# EAGLE design jinks_01_release (EAGLE 9.3.2)

## Sheet 1 of 4
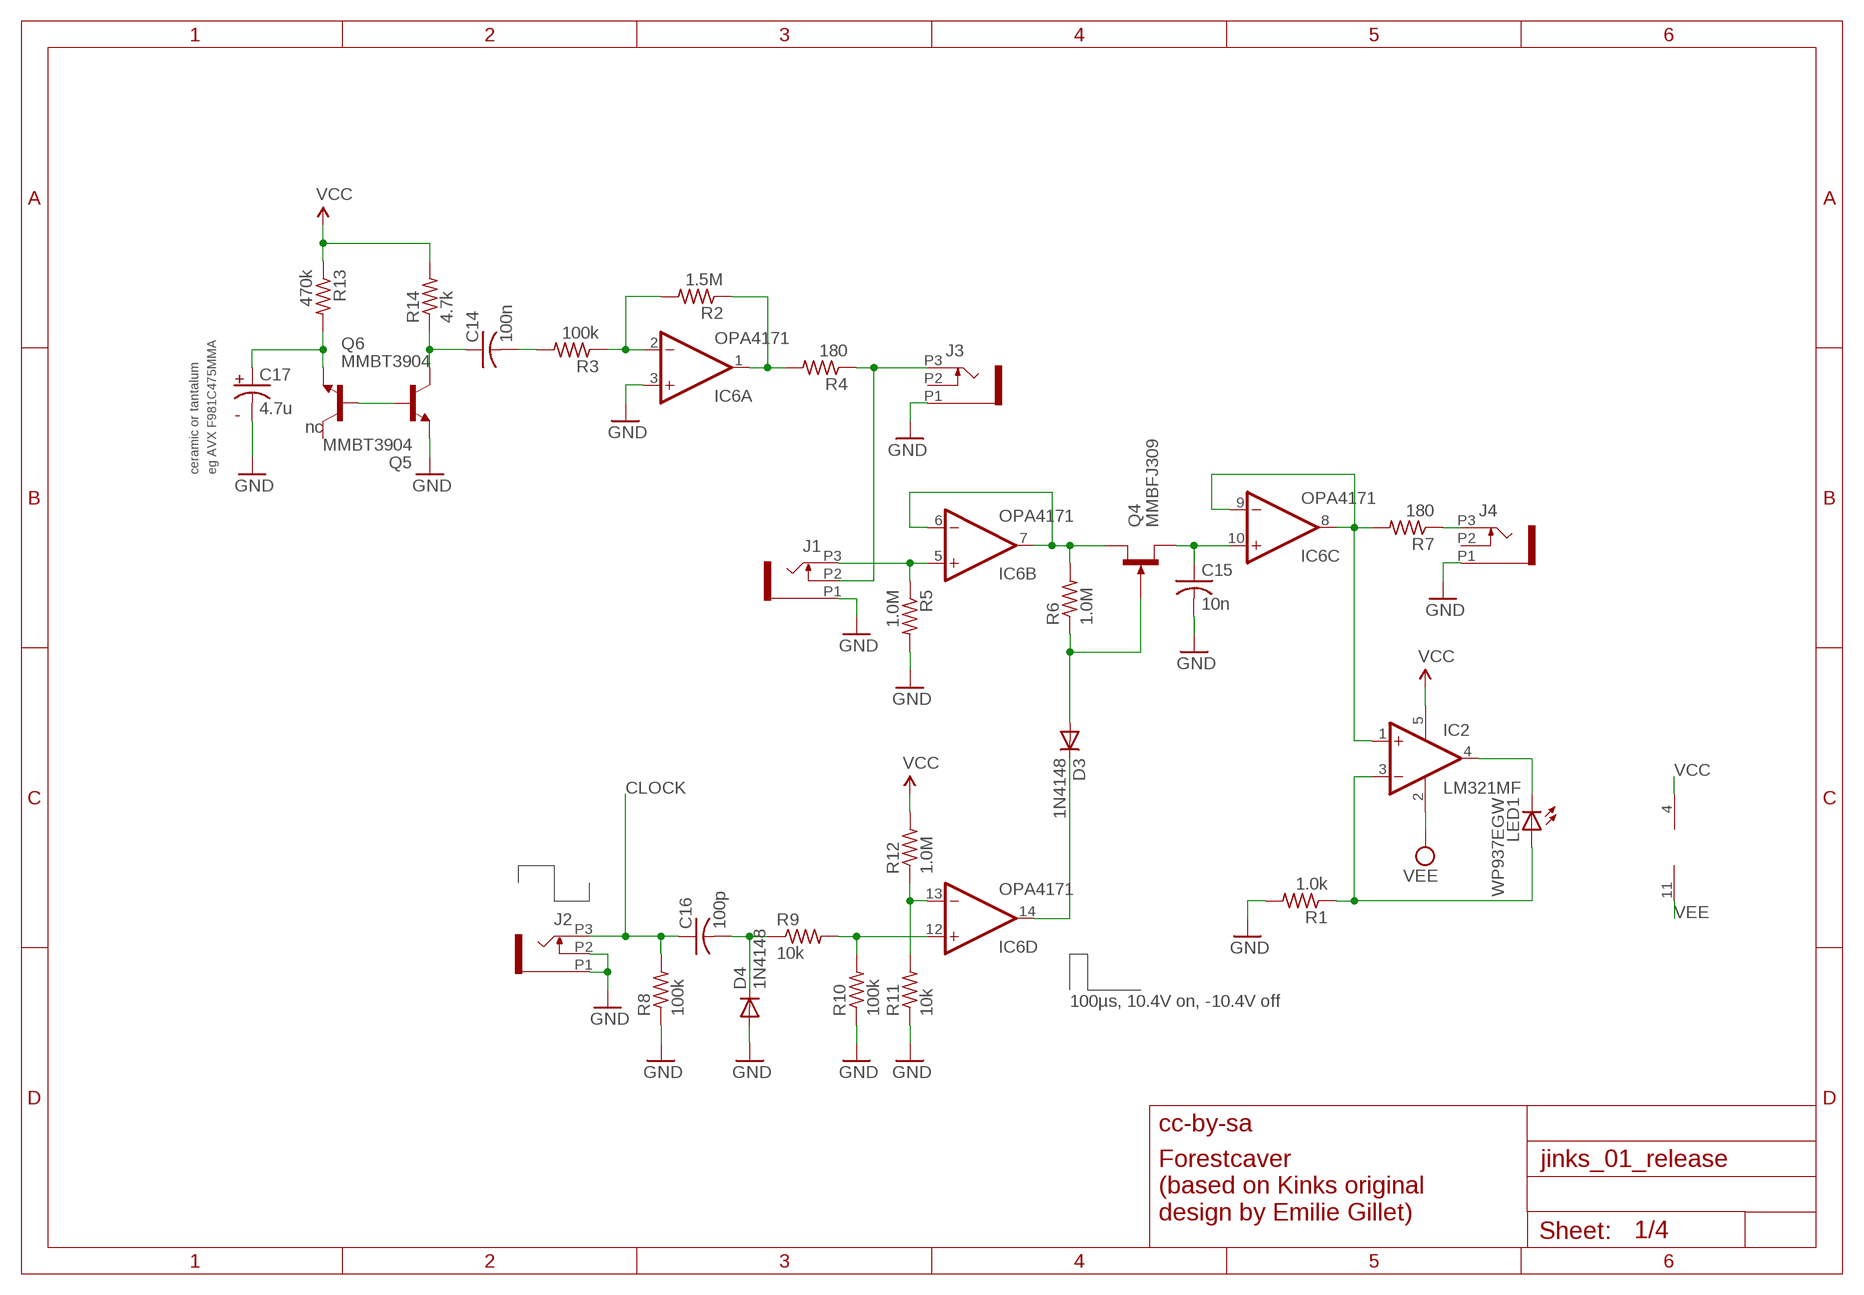
[diagram p0: schematic, sheet 1]

### Parts
C14  100n  C-USC0603  [C0603]
C15  10n  C-USC0603  [C0603]
C16  100p  C-USC0603  [C0603]
C17  4.7u  C-USC0603  [C0603]
D3  1N4148  DIODE-SOD523  [SOD523]
D4  1N4148  DIODE-SOD523  [SOD523]
IC2  LM321MF  [SOT23-5]
IC6  OPA4171  TL074PW  [TSSOP14]
J1  PJ301_THONKICONN6  [WQP_PJ_301M6]
J2  PJ301_THONKICONN6  [WQP_PJ_301M6]
J3  PJ301_THONKICONN6  [WQP_PJ_301M6]
J4  PJ301_THONKICONN6  [WQP_PJ_301M6]
LED1  WP937EGW  LED3MM  [LED3MM]
Q4  MMBFJ309  MMBFJ3  [SOT23]
Q5  MMBT3904  MMBT3904LT1-NPN-SOT23-BEC  [SOT23-BEC]
Q6  MMBT3904  MMBT3904LT1-NPN-SOT23-BEC  [SOT23-BEC]
R1  1.0k  R-US_R0603  [R0603]
R2  1.5M  R-US_R0603  [R0603]
R3  100k  R-US_R0603  [R0603]
R4  180  R-US_R0603  [R0603]
R5  1.0M  R-US_R0603  [R0603]
R6  1.0M  R-US_R0603  [R0603]
R7  180  R-US_R0603  [R0603]
R8  100k  R-US_R0603  [R0603]
R9  10k  R-US_R0603  [R0603]
R10  100k  R-US_R0603  [R0603]
R11  10k  R-US_R0603  [R0603]
R12  1.0M  R-US_R0603  [R0603]
R13  470k  R-US_R0603  [R0603]
R14  4.7k  R-US_R0603  [R0603]

### Nets
CLOCK: C16.1 J2.P3 R8.2 ; also sheet 2,3
GND: C15.2 C17.2 D4.A IC6.3(A:+IN) J1.P1 J2.P1 J2.P2 J3.P1 J4.P1 Q6.E R1.2 R5.2 R8.1 R10.1 R11.1 ; also sheet 2,3,4
N$1: IC2.4(OUT) LED1.K(C)
N$2: IC2.3(-IN) LED1.A R1.1
N$4: IC2.1(+IN) IC6.8(C:OUT) IC6.9(C:-IN) R7.2
N$5: IC6.1(A:OUT) R2.1 R4.2
N$7: J1.P2 J3.P3 R4.1
N$9: IC6.5(B:+IN) J1.P3 R5.1
N$10: IC6.6(B:-IN) IC6.7(B:OUT) Q4.1(D) R6.2
N$11: D3.A Q4.3(G) R6.1
N$14: D3.C IC6.14(D:OUT)
N$15: C15.1 IC6.10(C:+IN) Q4.2(S)
N$17: J4.P3 R7.1
N$21: C16.2 D4.C R9.1
N$23: IC6.12(D:+IN) R9.2 R10.2
N$24: IC6.13(D:-IN) R11.2 R12.1
N$25: C14.2 R3.2
N$26: IC6.2(A:-IN) R2.2 R3.1
N$27: Q5.B Q6.B
N$28: C17.1 Q5.E R13.2
N$29: C14.1 Q6.C R14.1
VCC: IC2.5(V+) IC6.4(P:V+) R12.2 R13.1 R14.2 ; also sheet 2,3,4
VEE: IC2.2(V-) IC6.11(P:V-) ; also sheet 2,3,4
Unconnected: J3.P2 J4.P2 Q5.C

### Notes on the sheet
- +
- - | nc
- ceramic or tantalum | eg AVX F981C475MMA
- 100µs, 10.4V on, -10.4V off
- cc-by-sa
- Forestcaver
  (based on Kinks original
  design by Emilie Gillet)

## Sheet 2 of 4
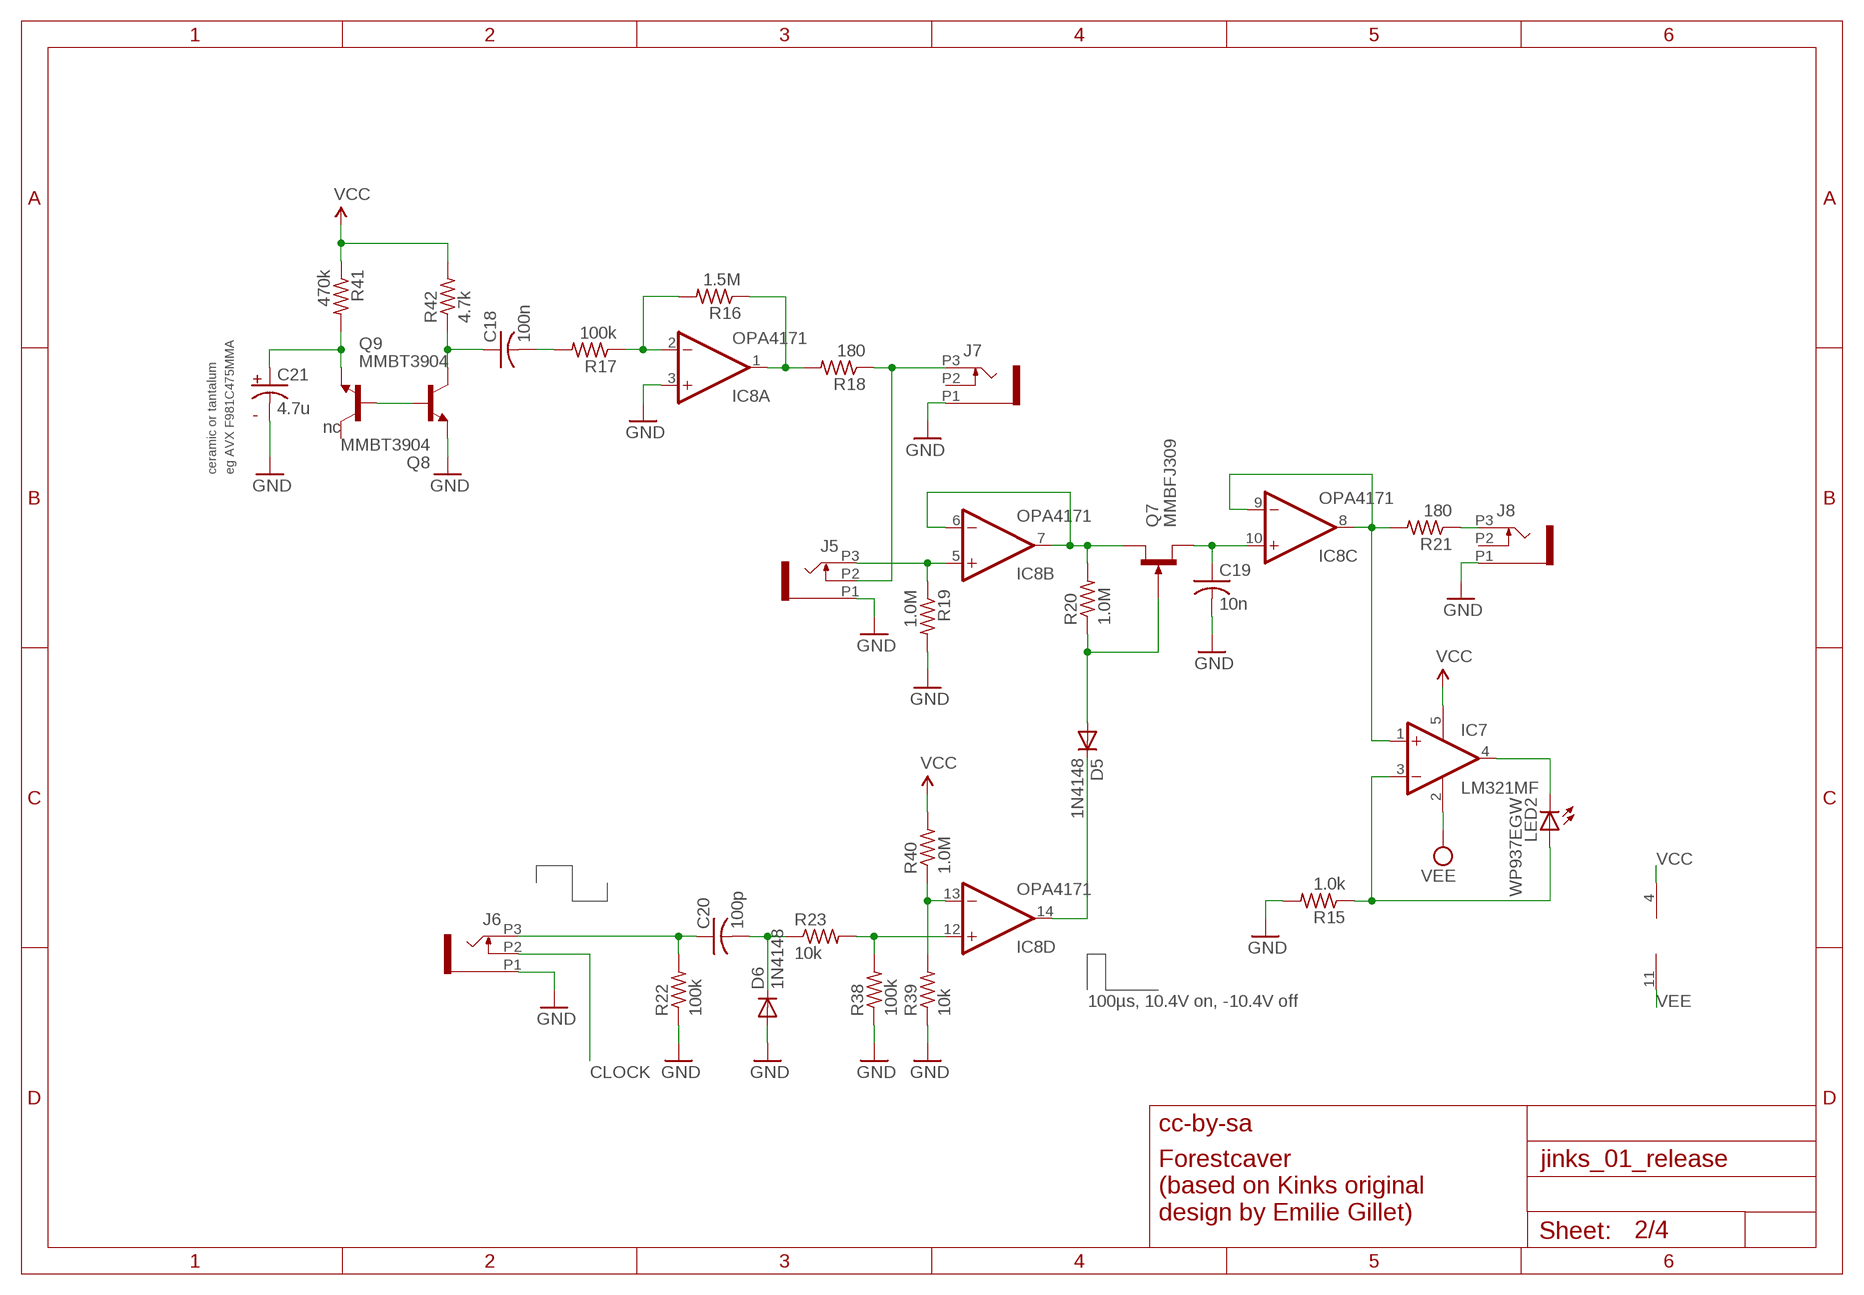
[diagram p1: schematic, sheet 2]

### Parts
C18  100n  C-USC0603  [C0603]
C19  10n  C-USC0603  [C0603]
C20  100p  C-USC0603  [C0603]
C21  4.7u  C-USC0603  [C0603]
D5  1N4148  DIODE-SOD523  [SOD523]
D6  1N4148  DIODE-SOD523  [SOD523]
IC7  LM321MF  [SOT23-5]
IC8  OPA4171  TL074PW  [TSSOP14]
J5  PJ301_THONKICONN6  [WQP_PJ_301M6]
J6  PJ301_THONKICONN6  [WQP_PJ_301M6]
J7  PJ301_THONKICONN6  [WQP_PJ_301M6]
J8  PJ301_THONKICONN6  [WQP_PJ_301M6]
LED2  WP937EGW  LED3MM  [LED3MM]
Q7  MMBFJ309  MMBFJ3  [SOT23]
Q8  MMBT3904  MMBT3904LT1-NPN-SOT23-BEC  [SOT23-BEC]
Q9  MMBT3904  MMBT3904LT1-NPN-SOT23-BEC  [SOT23-BEC]
R15  1.0k  R-US_R0603  [R0603]
R16  1.5M  R-US_R0603  [R0603]
R17  100k  R-US_R0603  [R0603]
R18  180  R-US_R0603  [R0603]
R19  1.0M  R-US_R0603  [R0603]
R20  1.0M  R-US_R0603  [R0603]
R21  180  R-US_R0603  [R0603]
R22  100k  R-US_R0603  [R0603]
R23  10k  R-US_R0603  [R0603]
R38  100k  R-US_R0603  [R0603]
R39  10k  R-US_R0603  [R0603]
R40  1.0M  R-US_R0603  [R0603]
R41  470k  R-US_R0603  [R0603]
R42  4.7k  R-US_R0603  [R0603]

### Nets
CLOCK: J6.P2 ; also sheet 1,3
GND: C19.2 C21.2 D6.A IC8.3(A:+IN) J5.P1 J6.P1 J7.P1 J8.P1 Q9.E R15.2 R19.2 R22.1 R38.1 R39.1 ; also sheet 1,3,4
N$32: IC7.4(OUT) LED2.K(C)
N$33: IC7.3(-IN) LED2.A R15.1
N$34: IC7.1(+IN) IC8.8(C:OUT) IC8.9(C:-IN) R21.2
N$35: IC8.1(A:OUT) R16.1 R18.2
N$38: J5.P2 J7.P3 R18.1
N$39: IC8.5(B:+IN) J5.P3 R19.1
N$47: IC8.6(B:-IN) IC8.7(B:OUT) Q7.1(D) R20.2
N$52: D5.A Q7.3(G) R20.1
N$53: D5.C IC8.14(D:OUT)
N$54: C19.1 IC8.10(C:+IN) Q7.2(S)
N$55: J8.P3 R21.1
N$56: C20.1 J6.P3 R22.2
N$57: C20.2 D6.C R23.1
N$58: IC8.12(D:+IN) R23.2 R38.2
N$59: IC8.13(D:-IN) R39.2 R40.1
N$60: C18.2 R17.2
N$61: IC8.2(A:-IN) R16.2 R17.1
N$62: Q8.B Q9.B
N$63: C21.1 Q8.E R41.2
N$64: C18.1 Q9.C R42.1
VCC: IC7.5(V+) IC8.4(P:V+) R40.2 R41.1 R42.2 ; also sheet 1,3,4
VEE: IC7.2(V-) IC8.11(P:V-) ; also sheet 1,3,4
Unconnected: J7.P2 J8.P2 Q8.C

### Notes on the sheet
- +
- - | nc
- ceramic or tantalum | eg AVX F981C475MMA
- 100µs, 10.4V on, -10.4V off
- cc-by-sa
- Forestcaver
  (based on Kinks original
  design by Emilie Gillet)

## Sheet 3 of 4
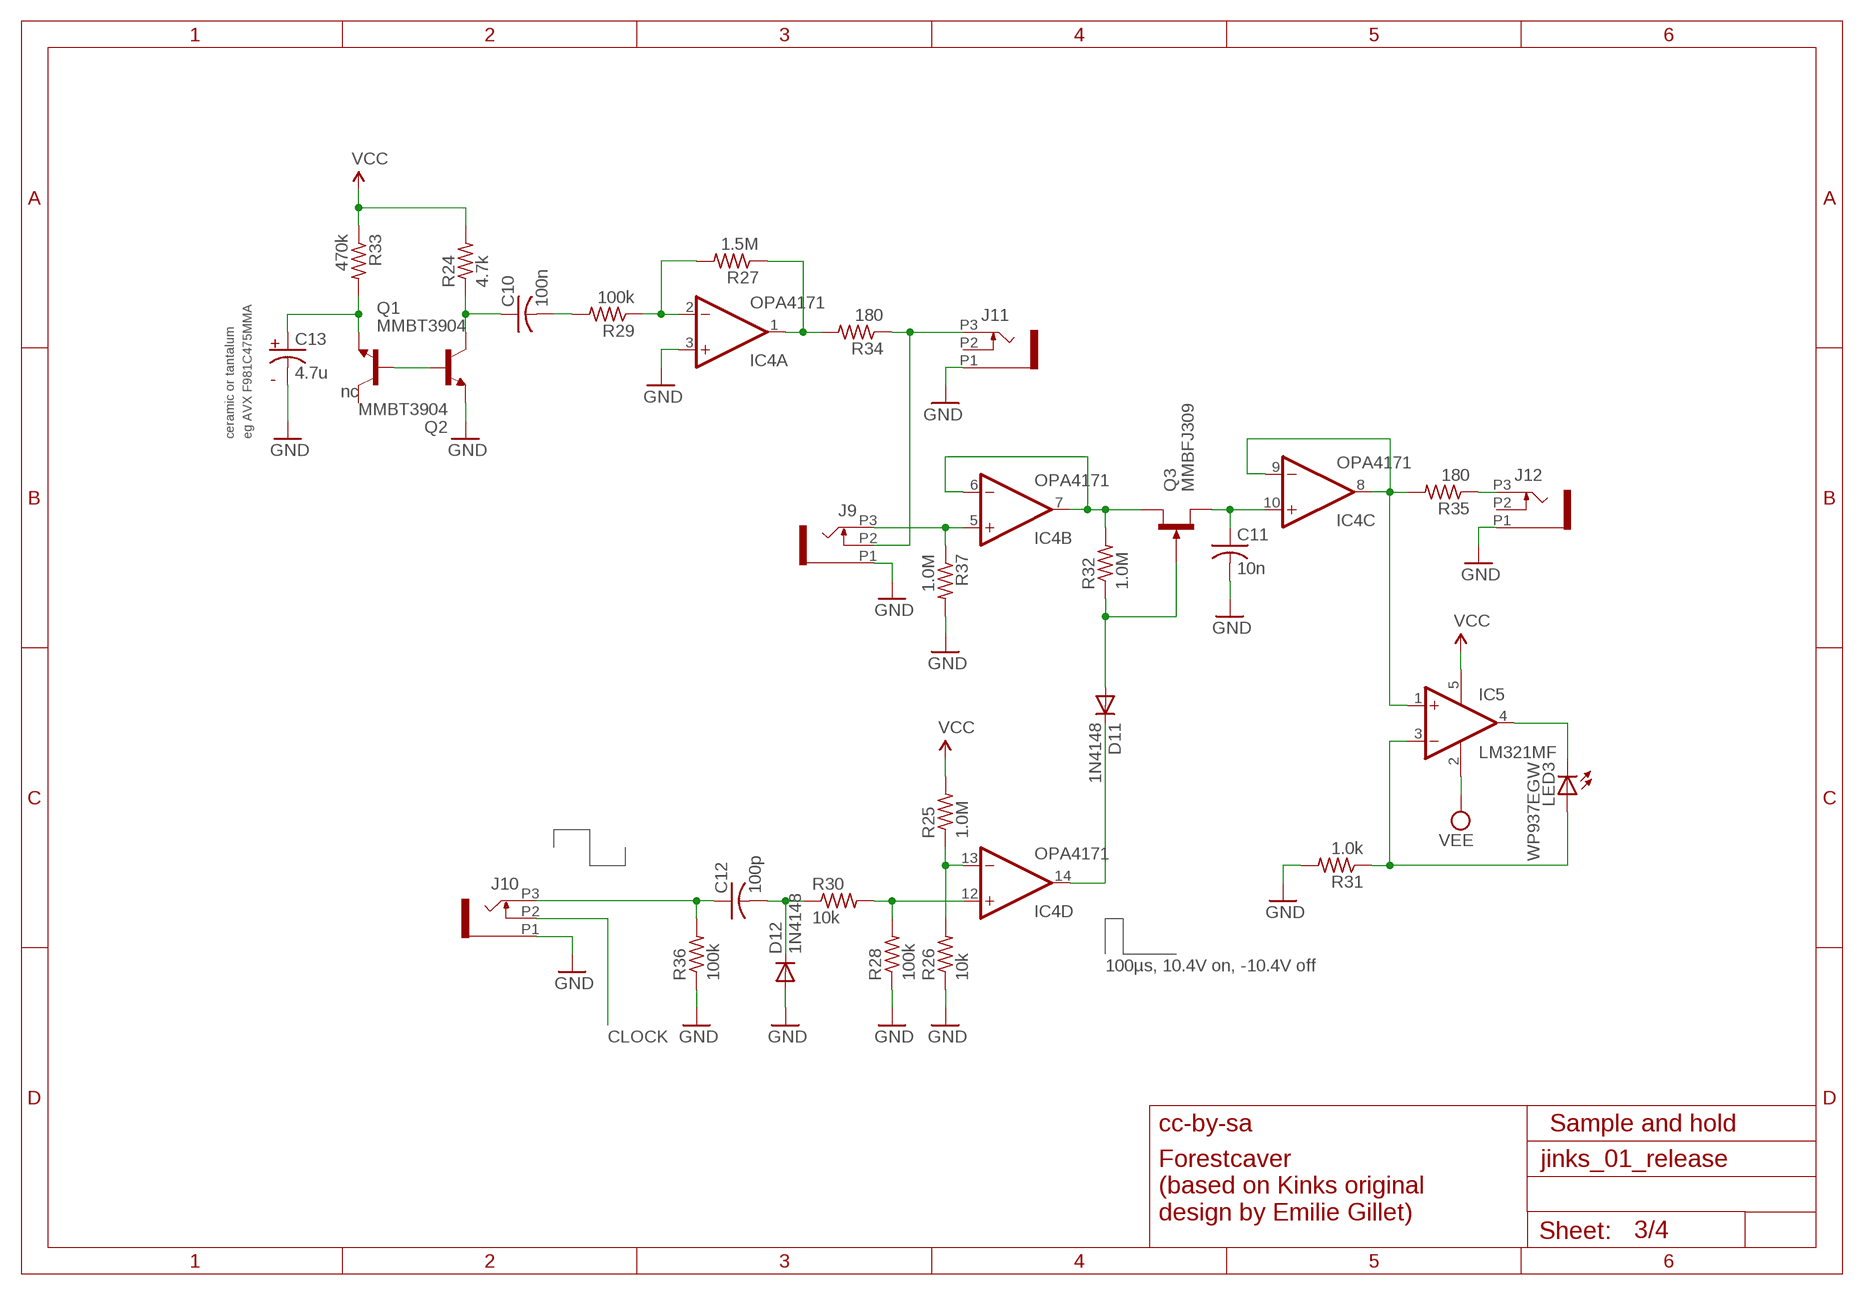
[diagram p2: schematic, sheet 3]

### Parts
C10  100n  C-USC0603  [C0603]
C11  10n  C-USC0603  [C0603]
C12  100p  C-USC0603  [C0603]
C13  4.7u  C-USC0603  [C0603]
D11  1N4148  DIODE-SOD523  [SOD523]
D12  1N4148  DIODE-SOD523  [SOD523]
IC4  OPA4171  TL074PW  [TSSOP14]
IC5  LM321MF  [SOT23-5]
J9  PJ301_THONKICONN6  [WQP_PJ_301M6]
J10  PJ301_THONKICONN6  [WQP_PJ_301M6]
J11  PJ301_THONKICONN6  [WQP_PJ_301M6]
J12  PJ301_THONKICONN6  [WQP_PJ_301M6]
LED3  WP937EGW  LED3MM  [LED3MM]
Q1  MMBT3904  MMBT3904LT1-NPN-SOT23-BEC  [SOT23-BEC]
Q2  MMBT3904  MMBT3904LT1-NPN-SOT23-BEC  [SOT23-BEC]
Q3  MMBFJ309  MMBFJ3  [SOT23]
R24  4.7k  R-US_R0603  [R0603]
R25  1.0M  R-US_R0603  [R0603]
R26  10k  R-US_R0603  [R0603]
R27  1.5M  R-US_R0603  [R0603]
R28  100k  R-US_R0603  [R0603]
R29  100k  R-US_R0603  [R0603]
R30  10k  R-US_R0603  [R0603]
R31  1.0k  R-US_R0603  [R0603]
R32  1.0M  R-US_R0603  [R0603]
R33  470k  R-US_R0603  [R0603]
R34  180  R-US_R0603  [R0603]
R35  180  R-US_R0603  [R0603]
R36  100k  R-US_R0603  [R0603]
R37  1.0M  R-US_R0603  [R0603]

### Nets
CLOCK: J10.P2 ; also sheet 1,2
GND: C11.2 C13.2 D12.A IC4.3(A:+IN) J9.P1 J10.P1 J11.P1 J12.P1 Q1.E R26.1 R28.1 R31.2 R36.1 R37.2 ; also sheet 1,2,4
N$3: IC4.8(C:OUT) IC4.9(C:-IN) IC5.1(+IN) R35.2
N$8: Q1.B Q2.B
N$12: C13.1 Q2.E R33.2
N$13: C10.2 R29.2
N$16: IC4.2(A:-IN) R27.2 R29.1
N$19: IC5.3(-IN) LED3.A R31.1
N$30: IC5.4(OUT) LED3.K(C)
N$31: C10.1 Q1.C R24.1
N$36: IC4.1(A:OUT) R27.1 R34.2
N$37: J9.P2 J11.P3 R34.1
N$40: IC4.5(B:+IN) J9.P3 R37.1
N$41: IC4.6(B:-IN) IC4.7(B:OUT) Q3.1(D) R32.2
N$42: D11.A Q3.3(G) R32.1
N$43: D11.C IC4.14(D:OUT)
N$45: C11.1 IC4.10(C:+IN) Q3.2(S)
N$46: IC4.12(D:+IN) R28.2 R30.2
N$48: J12.P3 R35.1
N$49: C12.1 J10.P3 R36.2
N$50: IC4.13(D:-IN) R25.1 R26.2
N$51: C12.2 D12.C R30.1
VCC: IC5.5(V+) R24.2 R25.2 R33.1 ; also sheet 1,2,4
VEE: IC5.2(V-) ; also sheet 1,2,4
Unconnected: J11.P2 J12.P2 Q2.C

### Notes on the sheet
- +
- - | nc
- ceramic or tantalum | eg AVX F981C475MMA
- 100µs, 10.4V on, -10.4V off
- cc-by-sa | Sample and hold
- Forestcaver
  (based on Kinks original
  design by Emilie Gillet)

## Sheet 4 of 4
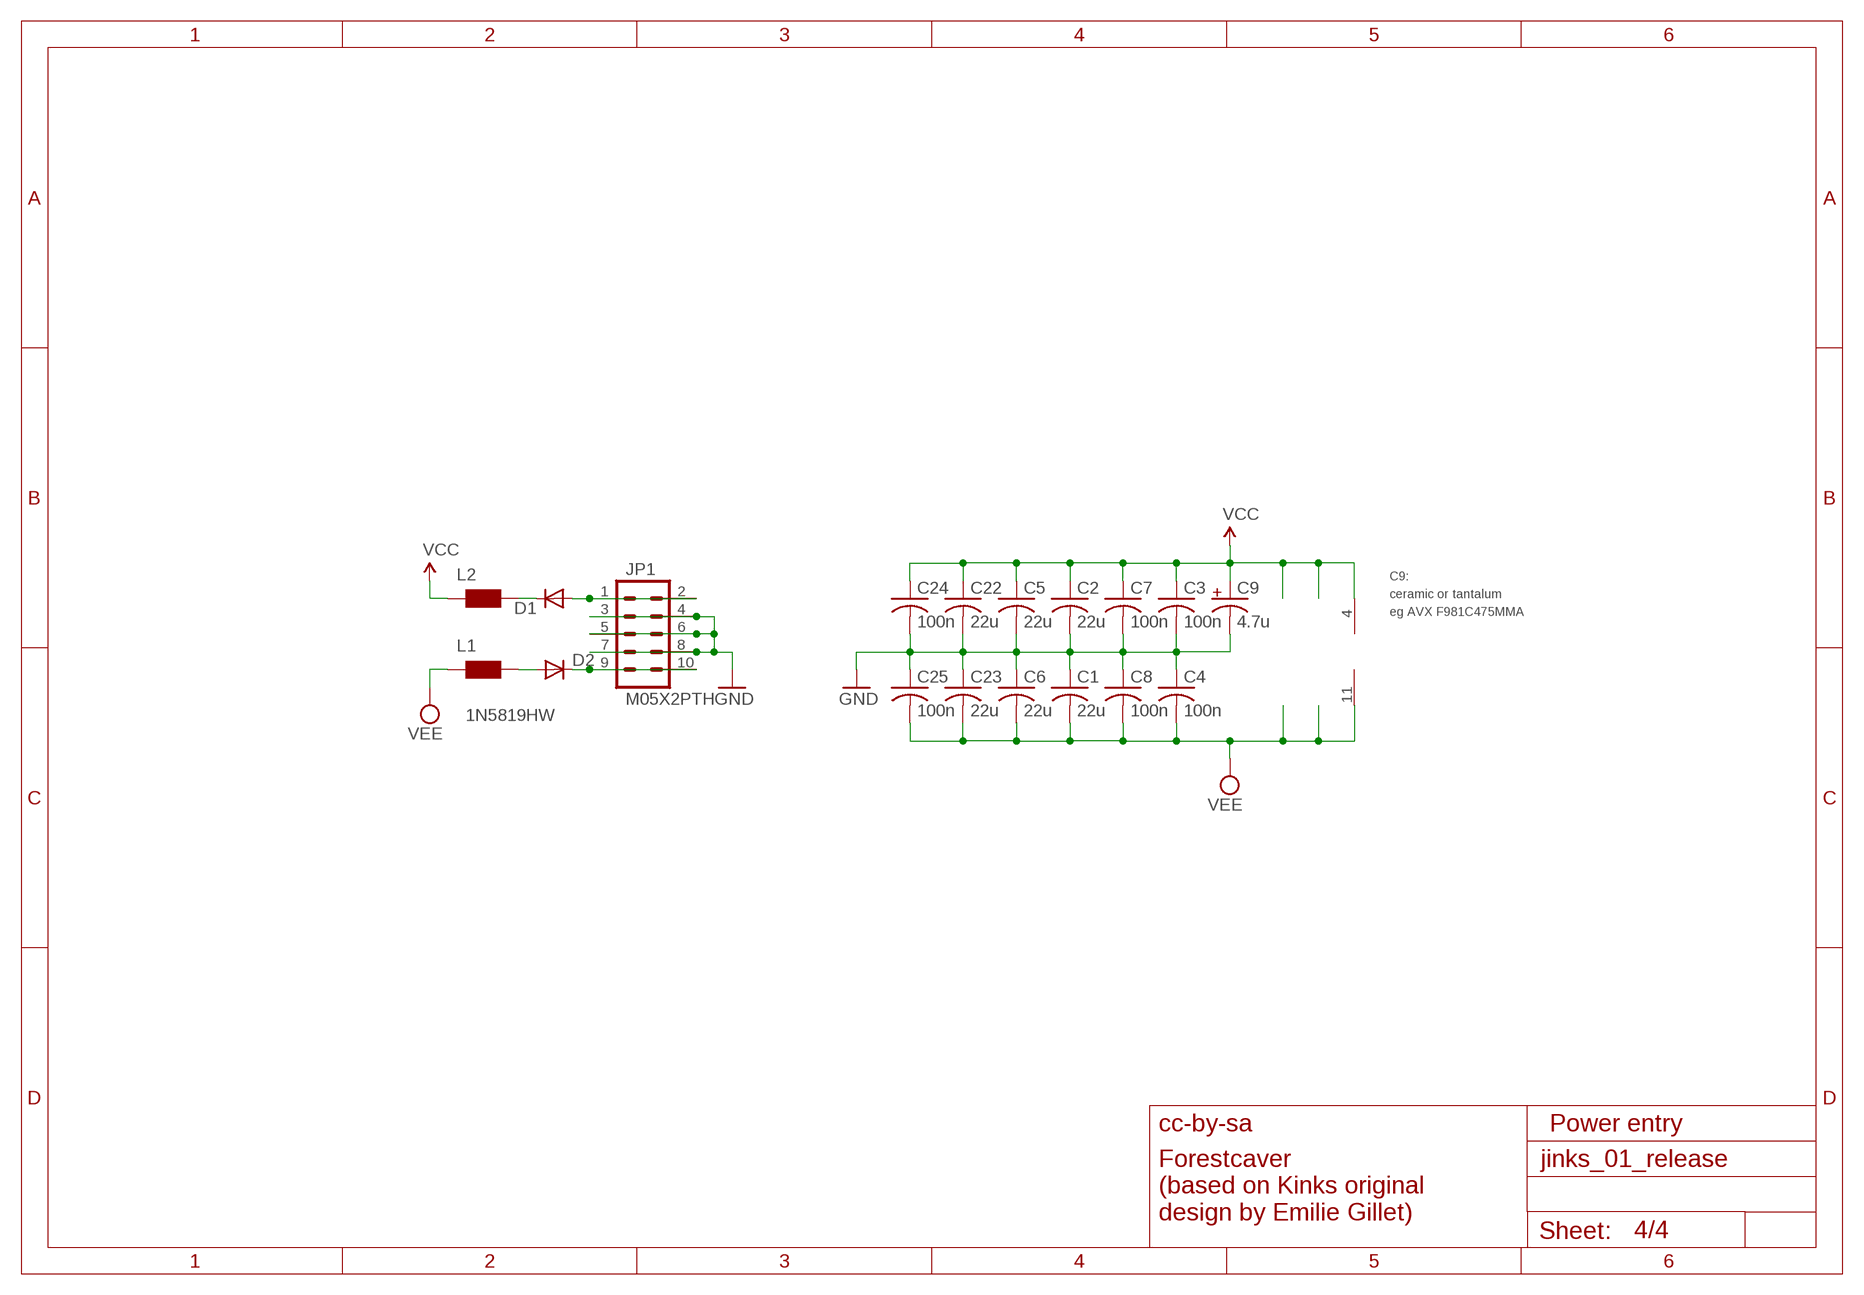
[diagram p3: schematic, sheet 4]

### Parts
C1  22u  C-USC0805  [C0805]
C2  22u  C-USC0805  [C0805]
C3  100n  C-USC0603  [C0603]
C4  100n  C-USC0603  [C0603]
C5  22u  C-USC0805  [C0805]
C6  22u  C-USC0805  [C0805]
C7  100n  C-USC0603  [C0603]
C8  100n  C-USC0603  [C0603]
C9  4.7u  C-USC0603  [C0603]
C22  22u  C-USC0805  [C0805]
C23  22u  C-USC0805  [C0805]
C24  100n  C-USC0603  [C0603]
C25  100n  C-USC0603  [C0603]
D1  1N5819HW  DIODE-SOD123  [SOD123]
D2  1N5819HW  DIODE-SOD123  [SOD123]
JP1  M05X2PTH  [AVR_ICSP]
L1  WE-CBF_0603  [0603]
L2  WE-CBF_0603  [0603]

### Nets
GND: C1.1 C2.2 C3.2 C4.1 C5.2 C6.1 C7.2 C8.1 C9.2 C22.2 C23.1 C24.2 C25.1 JP1.3 JP1.4 JP1.5 JP1.6 JP1.7 JP1.8 ; also sheet 1,2,3
N$6: D1.A JP1.1 JP1.2
N$20: D2.C JP1.9 JP1.10
N$22: D1.C L2.2
N$44: D2.A L1.2
VCC: C2.1 C3.1 C5.1 C7.1 C9.1 C22.1 C24.1 IC4.4(P:V+) L2.1 ; also sheet 1,2,3
VEE: C1.2 C4.2 C6.2 C8.2 C23.2 C25.2 IC4.11(P:V-) L1.1 ; also sheet 1,2,3

### Notes on the sheet
- C9:
- + | ceramic or tantalum
- eg AVX F981C475MMA
- cc-by-sa | Power entry
- Forestcaver
  (based on Kinks original
  design by Emilie Gillet)

## Library data of the parts
C1-C25 = rcl:C-US: CAPACITOR, American symbol
D1-D6 D11 D12 = diode:DIODE-: DIODE
IC2 IC5 IC7 = linear:LM321?*: Low Power Single Op Amp Source: http://cache.national.com/ds/LM/LM321.pdf
IC4 IC6 IC8 = linear:TL074: OP AMP
J1-J12 = og-pj301:PJ301_THONKICONN
JP1 = og-header:M05X2: Header 5x2 Standard 10-pin dual row 0.1" header. Commonly used with AVR-ISP. Use with Spark Fun Electronics SKU: PRT-00778
L1 L2 = wuerth-elektronik:WE-CBF: SMD EMI Suppression Ferrite Beads - excellent anti-EMI properties - low DCR - impedances till 3000 ohms - rated current up to 6 A
LED1-LED3 = led:LED: LED OSRAM: - CHIPLED LG R971, LG N971, LY N971, LG Q971, LY Q971, LO R971, LY R971 LH N974, LH R974 LS Q976, LO Q976, LY Q976 LO Q996 - Hyper CHIPLED LW Q18S LB Q993, LB Q99A, LB R99A - SideLED LS A670, LO A670, LY A670, LG A670, LP A670 LB A673, LV A673, LT A673, LW A673 LH A674 LY A675 LS A676, LA A676, LO A676, LY A676, LW A676 LS A679, LY A679, LG A679 - Hyper Micro SIDELED® LS Y876, LA Y876, LO Y876, LY Y876 LT Y87S - SmartLED LW L88C, LW L88S LB L89C, LB L89S, LG L890 LS L89K, LO L89K, LY L89K LS L896, LA L896, LO L896, LY L896 - TOPLED LS T670, LO T670, LY T670, LG T670, LP T670 LSG T670, LSP T670, LSY T670, LOP T670, LYG T670 LG T671, LOG T671, LSG T671 LB T673, LV T673, LT T673, LW T673 LH T674 LS T676, LA T676, LO T676, LY T676, LB T676, LH T676, LSB T676, LW T676 LB T67C, LV T67C, LT T67C, LS T67K, LO T67K, LY T67K, LW E67C LS E67B, LA E67B, LO E67B, LY E67B, LB E67C, LV E67C, LT E67C LW T67C LS T679, LY T679, LG T679 LS T770, LO T770, LY T770, LG T770, LP T770 LB T773, LV T773, LT T773, LW T773 LH T774 LS E675, LA E675, LY E675, LS T675 LS T776, LA T776, LO T776, LY T776, LB T776 LHGB T686 LT T68C, LB T68C - Hyper Mini TOPLED® LB M676 - Mini TOPLED Santana® LG M470 LS M47K, LO M47K, LY M47K Source: http://www.osram.convergy.de LUXEON: - LUMILED® LXK2-PW12-R00, LXK2-PW12-S00, LXK2-PW14-U00, LXK2-PW14-V00 LXK2-PM12-R00, LXK2-PM12-S00, LXK2-PM14-U00 LXK2-PE12-Q00, LXK2-PE12-R00, LXK2-PE12-S00, LXK2-PE14-T00, LXK2-PE14-U00 LXK2-PB12-K00, LXK2-PB12-L00, LXK2-PB12-M00, LXK2-PB14-N00, LXK2-PB14-P00, LXK2-PB14-Q00 LXK2-PR12-L00, LXK2-PR12-M00, LXK2-PR14-Q00, LXK2-PR14-R00 LXK2-PD12-Q00, LXK2-PD12-R00, LXK2-PD12-S00 LXK2-PH12-R00, LXK2-PH12-S00 LXK2-PL12-P00, LXK2-PL12-Q00, LXK2-PL12-R00 Source: www.luxeon.com KINGBRIGHT: KA-3528ASYC Source: www.kingbright.com
Q1 Q2 Q5 Q6 Q8 Q9 = transistor:*-NPN-: NPN Transistror BF959 corrected 2008.03.06
Q3 Q4 Q7 = transistor-small-signal:MMBFJ3*: N-Channel RF Amplifier Source: http://www.fairchildsemi.com/pf/J3/J310.html
R1-R42 = rcl:R-US_: RESISTOR, American symbol

## Board
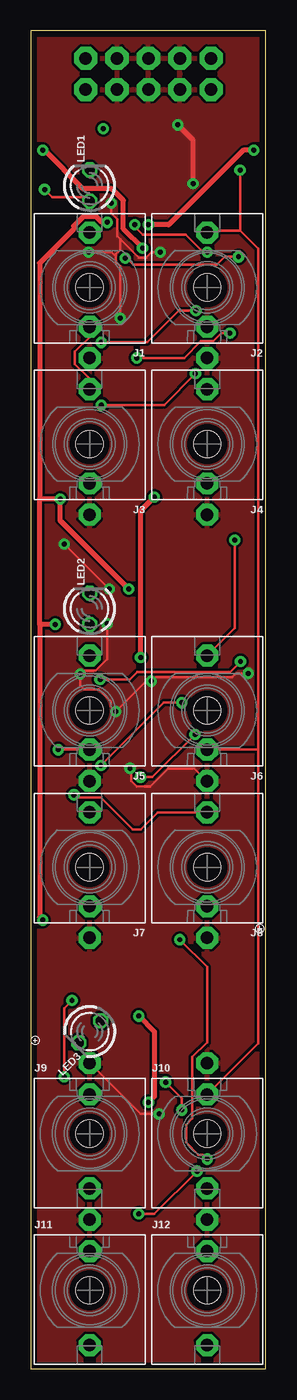
[diagram p4: board, top side]
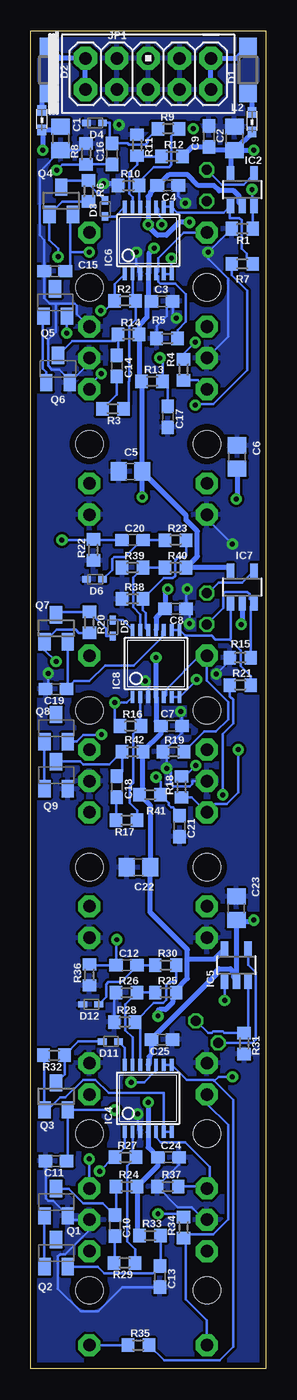
[diagram p5: board, bottom side, seen from below]

Size 19.03 x 108.43 mm. Coordinates in mm from the lower left corner, seen from the top.
Outline: 0,0 19.03,0 19.03,108.43 0,108.43 0,0
Copper layers (1*16): Top 0.035mm / dielectric 1.5mm / Bottom 0.035mm
Design rules "PCBCart-Standard *": minimum track width 8mil, minimum drill 0.4mm, track to track 8mil, track to pad 8mil, pad to pad 8mil, via to via 8mil, smd to smd 8mil, copper to edge 20mil, drill to drill 8mil, minimum pad ring 8mil, minimum via ring 10mil, stop-mask expansion 3mil, vias tented up to drill 25mil, thermal gap 8mil

### Footprints (pad centres in the part's own frame; a part is rotated, then mirrored left to right if it is on the bottom)
C0805 = smd 1.3 x 1.5: 1 -0.95,0; 2 0.95,0
C0603 = smd 1.1 x 1: 1 -0.85,0; 2 0.85,0
SOD123 = smd 1.4 x 1.4: A 1.9,0; C -1.9,0
SOD523 = smd 0.7 x 0.5: A 0.7,0; C -0.6,0
SOT23-5 = smd 0.6 x 1.2: 1 -0.95,-1.306; 2 0,-1.306; 3 0.95,-1.306; 4 0.95,1.306; 5 -0.95,1.306
TSSOP14 = smd 0.305 x 0.991: 1 -1.905,-2.718; 2 -1.27,-2.718; 3 -0.635,-2.718; 4 0,-2.718; 5 0.635,-2.718; 6 1.27,-2.718; 7 1.905,-2.718; 8 1.905,2.718; 9 1.27,2.718; 10 0.635,2.718; 11 0,2.718; 12 -0.635,2.718; 13 -1.27,2.718; 14 -1.905,2.718
WQP_PJ_301M6 = drill 1.016 pad 1.778 octagon: P1 0,-5.715; P2 0,-3.175; P3 0,4.445 | hole 2.2: 0,0
AVR_ICSP = drill 1.016 pad 1.88 octagon: 1 -1.27,5.08; 2 1.27,5.08; 3 -1.27,2.54; 4 1.27,2.54; 5 -1.27,0; 6 1.27,0; 7 -1.27,-2.54; 8 1.27,-2.54; 9 -1.27,-5.08; 10 1.27,-5.08
0603 = smd 0.85 x 0.7: 1 -0.9,0; 2 0.7,0
LED3MM = drill 0.813 octagon: A -1.27,0; K 1.27,0
SOT23-BEC = smd 1 x 1.4: B -0.95,-1.1; C 0,1.1; E 0.95,-1.1
SOT23 = smd 1 x 1.4: 1 -0.95,-1.1; 2 0.95,-1.1; 3 0,1.1
R0603 = smd 1 x 1.1: 1 -0.85,0; 2 0.85,0

### Placement (x,y rotation side)
C1  16.61,99.7 90 bottom
C2  2.54,99.69 90 bottom
C3  8.39,86.51 0 bottom
C4  7.94,95.89 180 bottom
C5  10.95,72.71 180 bottom
C6  2.32,73.88 270 bottom
C7  7.65,52.09 0 bottom
C8  7.3,61.59 180 bottom
C9  4.6,99.85 90 bottom
C10  12.22,11.59 270 bottom
C11  16.99,16.83 180 bottom
C12  11.27,32.7 0 bottom
C13  8.57,7.46 270 bottom
C14  12.06,81.28 270 bottom
C15  17.09,88.95 180 bottom
C16  12.45,98.46 90 bottom
C17  7.94,77.15 270 bottom
C18  12.06,47.15 270 bottom
C19  16.99,55.09 180 bottom
C20  10.79,67.15 0 bottom
C21  6.99,43.97 270 bottom
C22  10.32,40.64 180 bottom
C23  2.38,37.31 270 bottom
C24  7.88,17.13 0 bottom
C25  8.41,26.67 180 bottom
D1  1.43,105.25 90 bottom
D2  17.62,105.25 270 bottom
D3  13.02,93.98 90 bottom
D4  13.81,100.97 180 bottom
D5  12.38,60.08 270 bottom
D6  13.81,63.98 180 bottom
D11  12.54,26.51 180 bottom
D12  14.13,29.53 180 bottom
IC2  1.91,95.57 0 bottom
IC4  9.52,21.91 0 bottom
IC5  2.38,32.7 0 bottom
IC6  9.53,91.44 0 bottom
IC7  1.91,63.34 0 bottom
IC8  8.89,57.15 0 bottom
J1  4.76,87.63 0 top
J2  14.29,87.63 0 top
J3  4.76,74.93 0 top
J4  14.29,74.93 0 top
J5  4.76,53.34 0 top
J6  14.29,53.34 0 top
J7  4.76,40.64 0 top
J8  14.29,40.64 0 top
J9  4.76,19.05 180 top
J10  14.29,19.05 180 top
J11  4.76,6.35 180 top
J12  14.29,6.35 180 top
JP1  9.53,104.93 270 bottom
L1  18.14,101.28 90 bottom
L2  1.11,101.12 90 bottom
LED1  4.76,95.89 90 top
LED2  4.76,61.59 90 top
LED3  4.76,27.3 225 top
Q1  16.99,13.49 0 bottom
Q2  16.99,9.37 0 bottom
Q3  16.99,22.07 0 bottom
Q4  16.57,94.65 0 bottom
Q5  17.06,86.41 0 bottom
Q6  16.83,81.02 0 bottom
Q7  16.99,60.01 0 bottom
Q8  16.99,51.91 0 bottom
Q9  16.99,48.1 0 bottom
R1  1.91,92.39 180 bottom
R2  11.39,86.54 0 bottom
R3  12.38,77.79 180 bottom
R4  6.67,80.96 90 bottom
R5  7.99,83.49 180 bottom
R6  14.35,95.44 270 bottom
R7  1.91,89.53 0 bottom
R8  14.55,98.44 270 bottom
R9  7.89,100.49 0 bottom
R10  11.11,95.89 0 bottom
R11  10.41,99.16 270 bottom
R12  7.59,98.24 0 bottom
R13  9.21,80.01 0 bottom
R14  11.11,83.82 0 bottom
R15  2.06,57.63 180 bottom
R16  10.95,52.09 0 bottom
R17  11.27,44.45 180 bottom
R18  6.83,47.15 90 bottom
R19  7.46,50.01 180 bottom
R20  14.29,60.48 270 bottom
R21  2.06,55.4 0 bottom
R22  13.97,66.36 90 bottom
R23  7.3,67.15 0 bottom
R24  11.27,14.76 0 bottom
R25  8.1,30.48 0 bottom
R26  11.27,30.48 0 bottom
R27  11.37,17.13 0 bottom
R28  11.43,28.1 0 bottom
R29  11.43,8.57 180 bottom
R30  8.1,32.7 0 bottom
R31  1.75,26.35 270 bottom
R32  17.15,25.4 180 bottom
R33  9.37,10.79 0 bottom
R34  6.67,11.43 90 bottom
R35  10.32,1.91 0 bottom
R36  14.29,31.91 90 bottom
R37  7.94,14.76 180 bottom
R38  10.79,62.39 0 bottom
R39  10.79,64.93 0 bottom
R40  7.3,64.93 0 bottom
R41  9.37,46.51 0 bottom
R42  10.79,50.01 0 bottom

### Tracks (layer width: path | path; a pad name or v marks a point on that pad's centre or on a via)
CLOCK  (via drill 0.4)
  Top 0.203: J10.P2 18.42,26.36 18.42,50.16 | 18.42,50.16 J6.P2 | 18.42,50.16 18.42,90.76 16.95,92.23 | 16.95,92.23 v16.95,97.13 | 16.95,92.23 14.44,92.23 J2.P3
  Bottom 0.203: C16.1 14.54,97.61 R8.2 16.48,97.59 v16.95,97.13
GND  (via drill 0.4)
  Top 0.203: J6.P1 13.26,48.66 11.13,48.66 9.66,47.18 8.58,47.18 8.13,47.63 8.13,48.56 v8.03,48.66 | v10.48,90.49 9.8,90.49 9.36,90.05 8.73,90.05 7.23,91.55 | v17.62,56.36 16.61,56.36 16.32,56.07 10.1,56.07 v9.75,55.72 9.34,55.72 v6.88,53.26 6.47,53.68 6.47,54.07 5.5,55.05 4.34,55.05 4,55.38 v4,56.29 4.3,56.59 5.26,56.59 6.17,57.51 v6.17,60.38 | v6.35,63.18 v2.7,66.83 | v10.38,20.64 8.89,20.64 J9.P1 | v6.51,94.46 6.51,93.65 6.99,93.17 6.99,91.8 7.23,91.55 | v7.23,85.15 7.23,89.34 6.88,89.69 6.88,90.12 | 6.88,90.12 6.88,90.32 7.23,90.68 7.23,91.55 | v4.67,90.5 6.5,90.5 6.88,90.12
  Top 0.406: v13.14,96.04 13.14,99.55 v11.89,100.81
  Bottom 0.203: J5.P1 5.93,47.62 5.97,47.58 5.97,47.37 6.15,47.19 7.5,47.19 7.68,47.37 7.68,48.3 v8.03,48.66 8.03,49.73 R19.2 6.79,51.52 C7.2 6.79,53.17 v6.88,53.26 | v7.23,85.15 7.54,85.46 C3.2 8.03,86.03 8.03,85.29 8.84,84.48 R5.2 | IC6.3 10.34,88.9 10.34,89.34 10.48,89.48 v10.48,90.49 | R15.2 2.91,57.38 v4,56.29 | C19.2 17.62,55.3 v17.62,56.36 | v9.75,55.72 9.53,55.49 IC8.3 | v6.35,63.18 6.45,63.08 C8.1 6.17,61.32 v6.17,60.38 | v2.7,66.83 4.76,68.9 J3.P1 | IC4.3 10.34,19.37 10.34,19.81 10.38,19.86 v10.38,20.64 | C24.2 7.03,16.52 R37.2 7.11,13.09 5.99,13.09 4.97,12.06 J11.P1 | C11.2 17.84,13.81 17.61,13.59 17.23,13.59 Q1.E 15.71,12.06 J12.P1 14.29,11.21 16.23,9.27 16.66,9.27 16.84,9.09 16.84,6.49 15,4.64 13.58,4.64 11.61,6.61 C13.2 | R28.1 12.28,30.32 R26.1 | R8.1 15.1,98.75 C1.1 18.33,97.03 18.33,91.86 17.94,91.48 C15.2 17.94,86.76 17.5,86.32 17.02,86.32 | C4.1 7.09,95.04 v6.51,94.46 | R1.2 4.65,90.5 v4.67,90.5 4.67,89.96 3.05,88.34 3.05,83.62 J1.P1 | J2.P2 15.31,85.47 15.31,86.14 15.49,86.32 17.02,86.32 | 17.02,86.32 17.02,84.02 17.64,83.4 17.64,81.29 17.33,80.99 16.75,80.99 15.88,80.12 Q6.E 14.29,81.52 J2.P1
  Bottom 0.406: R10.1 12.12,96.04 v13.14,96.04
  pour Bottom: 0,108.43 0,0 19.05,0 19.05,108.43
  pour Top: 0,108.43 0,0 19.05,0 19.05,108.43
N$1
  Bottom 0.203: IC2.4 0.95,96.81 1.79,95.97 3.58,95.97 LED1.K
N$2  (via drill 0.4)
  Top 0.203: v1.11,95.57 1.75,94.93 4.13,94.93 4.45,94.61 LED1.A
  Bottom 0.203: R1.1 1.05,94.16 IC2.3 1.11,94.42 v1.11,95.57
N$3  (via drill 0.4)
  Top 0.203: v2.7,23.65 2.7,29.21 v3.33,29.84
  Bottom 0.203: IC4.9 IC4.8 6.41,23.42 4.27,23.42 4.16,23.31 | 4.16,23.31 2.65,21.8 2.65,1.76 3.74,0.67 8.23,0.67 R35.2 | 4.16,23.31 3.81,23.65 v2.7,23.65 | v3.33,29.84 IC5.1
N$4
  Bottom 0.203: IC6.9 IC6.8 7.16,93.7 3.42,93.7 IC2.1 2.92,94.2 2.92,93.25 2.13,93.25 1.95,93.07 1.95,90.79 1.54,90.38 1.54,90.02 R7.2
N$5  (via drill 0.4)
  Top 0.203: v5.71,83.19 9.42,83.19 12.02,85.78 12.04,85.75 v13.38,85.75
  Bottom 0.203: v5.71,83.19 6.67,82.23 R4.2 | v13.38,85.75 13.03,85.75 R2.1 12.24,87.91 IC6.1
N$6
  Bottom 0.406: D1.A 2.38,106.2 JP1.1 JP1.2
N$7
  Top 0.203: J3.P3 4.76,80.23 3.57,81.42 3.57,82.41 4.76,83.6 J1.P2
  Bottom 0.203: R4.1 5.5,80.11 J3.P3
N$8
  Bottom 0.203: Q1.B Q2.B | Q2.B
N$9
  Bottom 0.203: J1.P3 6.64,92.08 8.71,90.01 8.71,88.9 IC6.5 8.71,88.54 8.71,88.1 8.53,87.92 7.32,87.92 6.47,87.08 6.47,84.84 7.14,84.18 R5.1
N$10  (via drill 0.4)
  Top 0.203: v7.64,90.01 7.76,90.01 8.31,89.47 15.06,89.47 15.71,90.11 v16.82,90.11
  Bottom 0.203: IC6.6 IC6.7 7.64,88.74 v7.64,90.01 | v16.82,90.11 16.82,90.75 17.52,91.45 Q4.1 16.49,94.59 R6.2
N$11
  Bottom 0.203: Q4.3 16.04,96.29 R6.1 14.35,96.01 13.73,95.39 13.68,95.39 13.5,95.22 13.5,95.16 D3.A
N$12
  Bottom 0.203: Q2.E 13.61,8.27 13.06,7.72 9.17,7.72 C13.1 8.52,8.37 R33.2
N$13
  Bottom 0.203: R29.2 12.22,8.63 C10.2
N$14
  Bottom 0.203: D3.C 12.21,93.38 IC6.14
N$15  (via drill 0.4)
  Top 0.203: v8.41,92.71 8.41,92.55 9.05,91.92 12.54,91.92 13.97,90.49 v14.29,90.49
  Bottom 0.203: 15.82,90.5 15.82,93.36 Q4.2 | 15.82,90.5 15.82,89.38 C15.1 | IC6.10 8.71,93.98 8.71,93.54 8.41,93.24 v8.41,92.71 | 15.82,90.5 v14.3,90.5 v14.29,90.49
N$16
  Bottom 0.203: R29.1 10.58,9.68 11.23,10.32 11.23,16.42 R27.2 10.79,17.41 IC4.2
N$17  (via drill 0.4)
  Top 0.203: v5.71,78.11 10.79,78.11 v13.34,80.64
  Bottom 0.203: v5.71,78.11 5.64,78.18 4.27,78.18 1.5,80.95 1.5,87.36 2.75,88.61 R7.1 | v13.34,80.64 14.29,79.69 J4.P3
N$18  (via drill 0.4)
  other vias: 5.87,100.49
N$19
  Bottom 0.203: LED3.A 4.66,27.2 4.36,27.2 4.24,27.32 3.49,27.32 3.37,27.2 R31.1 1.43,27.52 IC5.3
N$20
  Bottom 0.406: JP1.10 JP1.9 16.67,106.2 D2.C
N$21
  Bottom 0.203: D4.C 12.65,100.97 12.65,99.5 C16.2 11.19,99.31 11.09,99.21 9.74,99.21 9.56,99.39 9.56,99.67 R9.1
N$22
  Bottom 0.406: L2.2 1.11,103.03 D1.C
N$23
  Bottom 0.203: IC6.12 10.26,94.26 R10.2 10.26,96.19 9.07,97.39 7.82,97.39 7.64,97.56 7.64,99.89 R9.2
N$24
  Bottom 0.203: IC6.13 10.79,94.94 11.07,95.21 11.07,96.92 10.41,97.58 R11.2 10.34,98.24 R12.1
N$25
  Bottom 0.203: C14.2 12.06,78.95 R3.2
N$26
  Bottom 0.203: IC6.2 10.79,86.79 R2.2 10.54,85.02 11.07,84.5 11.07,80.06 11.11,80.01 11.11,78.21 R3.1
N$27
  Bottom 0.203: Q5.B 18.06,85.26 18.06,81.04 17.78,80.76 Q6.B
N$28  (via drill 0.4)
  Top 0.203: v8.57,81.92 12.43,81.92 13.78,83.26 14.78,83.26 15.44,83.92 v16.13,83.92
  Bottom 0.203: Q5.E 16.13,85.29 v16.13,83.92 | C17.1 7.94,79.59 R13.2 8.36,81.7 v8.57,81.92
N$29
  Bottom 0.203: C14.1 11.96,82.23 11.96,83.5 | 11.96,83.5 R14.1 | Q6.C 15.69,83.26 12.2,83.26 11.96,83.5
N$30
  Bottom 0.203: IC5.4 1.43,32.73 0.83,32.12 0.83,26.64 1.07,26.4 2.42,26.4 2.43,26.41 LED3.K
N$31
  Bottom 0.203: Q1.C 15.96,14.59 14.78,13.41 13.2,13.41 C10.1 12.12,12.54 R24.1
N$32
  Bottom 0.203: LED2.K 4.57,62.87 4.57,62.94 3.81,63.7 1.91,63.7 IC7.4
N$33
  Bottom 0.203: R15.1 1.21,61.78 IC7.3 1.3,62.38 1.3,62.76 1.48,62.94 3.28,62.94 3.46,62.76 3.46,61.63 LED2.A
N$34
  Bottom 0.203: R21.2 1.21,56.15 2.02,56.95 2.02,58.21 2.91,59.11 | IC8.9 IC8.8 6.53,59.41 4.38,59.41 4.08,59.11 2.91,59.11 | IC7.1 2.85,59.17 2.91,59.11
N$35  (via drill 0.4)
  Top 0.203: v5.68,48.9 10.76,53.98 v12.22,53.98
  Bottom 0.203: R18.2 6.58,48 v5.68,48.9 | R16.1 12.22,52.51 v12.22,53.98 11.25,53.98 IC8.1
N$36  (via drill 0.4)
  Top 0.203: v13.46,16 10,12.54 v8.73,12.54
  Bottom 0.203: IC4.1 11.43,17.92 R27.1 12.34,17.13 v13.46,16 | v8.73,12.54 6.93,12.54 R34.2
N$37
  Bottom 0.203: J9.P2 4.76,21.47 3.05,19.76 3.05,12.09 4.27,10.87 6.38,10.87 R34.1 6.47,10.38 6.47,5.64 4.76,3.93 J11.P3
N$38  (via drill 0.4)
  Top 0.203: v2.22,50.16 J5.P2
  Bottom 0.203: R18.1 5.98,46.3 J7.P3 4.09,45.76 3.18,45.76 2.22,46.71 v2.22,50.16
N$39
  Bottom 0.203: IC8.5 8.08,54.61 8.08,55.05 5.35,57.78 J5.P3 4.76,55.76 3.05,54.05 3.05,52.63 4.05,51.63 4.99,51.63 R19.1
N$40
  Bottom 0.203: R37.1 4.92,14.76 J9.P3 4.53,14.84 4.53,16.36 6.51,18.34 8.49,18.34 8.89,18.73 IC4.5
N$41
  Bottom 0.203: R32.2 17.94,25.34 Q3.1 17.67,20.97 16.66,21.97 16.23,21.97 14.78,23.42 13.79,23.42 12.74,22.36 8.27,22.36 8.27,19.21 IC4.6 IC4.7
N$42
  Bottom 0.203: Q3.3 16.3,23.86 R32.1 15.18,26.51 D11.A
N$43
  Bottom 0.203: D11.C 11.43,26 IC4.14
N$44
  Bottom 0.406: D2.A 18.14,102.83 L1.2
N$45  (via drill 0.4)
  Top 0.203: v12.22,20.95 12.22,21.91 v10.91,23.22
  Bottom 0.203: C11.1 16.04,16.93 Q3.2 12.23,20.97 v12.22,20.95 | IC4.10 8.94,24.57 8.94,24.13 9.85,23.22 v10.91,23.22
N$46
  Bottom 0.203: IC4.12 10.16,27.68 R28.2 9.05,29.62 8.32,29.62 8.05,29.89 8.05,31.16 7.87,31.34 7.34,31.34 7.25,31.43 R30.2
N$47  (via drill 0.4)
  Top 0.203: v16.99,57.31 16.16,56.48 8.61,56.48 7.99,55.86 v5.61,55.86
  Bottom 0.203: IC8.6 IC8.7 5.61,55.81 v5.61,55.86 | v16.99,57.31 17.94,58.26 Q7.1 16.93,59.91 15.41,59.91 15.13,59.63 R20.2
N$48
  Bottom 0.203: J12.P3 R35.1
N$49  (via drill 0.4)
  Top 0.203: v12.06,34.77 14.29,32.54 14.29,26.45 13.09,25.26 13.09,20.27 12.58,19.76 12.58,18.34 13.58,17.34 13.94,17.34 v14.29,16.99
  Bottom 0.203: R36.2 14.23,32.7 C12.1 12.12,34.71 v12.06,34.77 | J10.P3 v14.29,16.99
N$50
  Bottom 0.203: R25.1 R26.2 11.38,29.52 11.38,27.42 10.79,26.83 IC4.13
N$51
  Bottom 0.203: R30.1 C12.2 10.42,32.63 11.72,31.34 12.75,31.34 12.93,31.16 12.93,30.13 D12.C
N$52
  Bottom 0.203: D5.A 12.91,59.38 12.94,59.41 12.94,59.98 R20.1 16.76,61.33 Q7.3
N$53
  Bottom 0.203: D5.C 11.6,60.68 IC8.14
N$54
  Bottom 0.203: Q7.2 16.04,55.19 C19.1 15.5,55.72 14.29,55.72 13.02,56.99 10.69,56.99 8.38,59.3 8.38,59.74 IC8.10
N$55  (via drill 0.4)
  Top 0.203: v3.49,46.51 3.73,46.28 5.67,46.28 8.26,43.69 8.89,43.69 10.28,45.09 J8.P3
  Bottom 0.203: R21.1 2.91,54.48 2.65,54.22 2.65,52.28 3.49,51.44 v3.49,46.51
N$56  (via drill 0.4)
  Top 0.203: J6.P3 16.51,60.01 v16.51,67.15
  Bottom 0.203: C20.1 13.91,67.15 | 13.91,67.15 R22.2 | v16.51,67.15 13.91,67.15
N$57
  Bottom 0.203: R23.1 9.84,67.15 C20.2 10.04,67.15 11.4,65.78 12.27,65.78 12.45,65.61 12.45,64.74 D6.C
N$58
  Bottom 0.203: R23.2 6.45,65.88 6.55,65.78 7.08,65.78 7.35,65.52 7.35,64.25 7.53,64.07 8.26,64.07 R38.2 9.95,61.48 9.7,61.24 9.7,60.05 IC8.12
N$59
  Bottom 0.203: R40.1 R39.2 10.75,64.12 10.75,61.71 10.16,61.12 IC8.13
N$60
  Bottom 0.203: R17.2 12.12,46.24 C18.2
N$61
  Bottom 0.203: IC8.2 10.16,52.15 R16.2 10.75,51.44 10.75,47.46 11.02,47.19 11.02,45.84 10.42,45.24 R17.1
N$62
  Bottom 0.203: Q8.B Q9.B
N$63  (via drill 0.4)
  Top 0.203: v13.31,51.41 9.84,47.94 v8.89,47.94
  Bottom 0.203: Q8.E 15.33,50.81 14.78,51.36 13.41,51.36 13.34,51.44 v13.31,51.41 | v8.89,47.94 8.52,47.57 R41.2 7.84,45.84 7.84,45.67 7.66,45.49 7.5,45.49 6.99,44.98 C21.1
N$64
  Bottom 0.203: C18.1 11.64,48.42 R42.1 12.68,48.97 14.78,48.97 15.01,49.2 Q9.C
VCC  (via drill 0.4)
  Top 0.406: v8.73,28.57 10,27.3 10,22.07 v9.53,21.59 | v8.89,57.63 8.89,69.53 v10,70.64 | v0.96,98.74 1.11,98.74 4.22,95.63 6.55,95.63 7.49,94.69 7.49,92.36 v9.05,90.81
  Bottom 0.406: C2.1 1.7,99.59 1.62,99.59 1.11,100.1 L2.1 | C2.1 4.34,98.75 C9.1 5.98,99 R12.2 | C2.1 v0.96,98.74 | v8.89,57.63 IC8.4 8.89,52.48 C7.1 8.49,51.46 R42.2 9.95,46.78 R41.1 9.37,45.67 C22.1 9.37,36.99 6.34,33.96 6.34,33.18 | C5.1 10.06,72.76 R13.1 10.26,80.03 R14.2 10.26,84.58 9.64,85.21 9.64,86.12 C3.1 9.53,86.79 IC6.4 9.45,88.8 9.45,90.41 v9.05,90.81 | 6.34,33.18 6.34,31.62 7.25,30.71 R25.2 7.54,30.18 7.54,29.68 8.11,29.12 8.61,29.12 8.73,29 v8.73,28.57 | IC5.5 4.16,33.18 6.34,33.18 | v9.53,21.59 IC4.4 | IC4.4 | IC4.4 9.53,17.92 C24.1 8.73,16.45 R24.2 10.42,11 R33.1 | C2.1 2.85,98.43 IC2.5 | C5.1 6.45,69.16 6.45,68.78 5.55,67.87 5.55,65.83 R40.2 3.14,64.93 IC7.5 | v10,70.64 C5.1
VEE  (via drill 0.4)
  Top 0.406: v18.07,98.74 17.2,98.74 11.17,92.71 v9.53,92.71 | v0.96,36.35 0.71,36.6 0.71,60.33 | v1.97,60.33 0.71,60.33 | 0.71,60.33 0.71,70.48 | 0.71,70.48 0.71,89.61 3.47,92.37 3.47,92.61 4.23,93.37 5.3,93.37 5.76,92.91 v6.18,92.91 | 0.71,70.48 v2.38,70.48 2.38,68.74 v7.94,63.18
  Bottom 0.406: IC8.11 8.89,60.86 C8.2 8.15,62.97 v7.94,63.18 | IC4.11 9.45,24.7 9.45,25.29 9.26,25.47 C25.2 4.04,31.9 4.04,32.16 3.8,32.4 2.86,32.4 2.62,32.16 2.62,31.79 2.31,31.47 IC5.2 2.38,36.2 | C23.2 2.38,36.2 | v0.96,36.35 1.12,36.2 2.38,36.2 | C1.2 16.88,100.38 L1.1 18.07,100.3 v18.07,98.74 | IC2.2 2.15,94.5 2.15,95.03 2.58,95.46 3.79,95.46 4.21,95.89 5.46,95.89 6.37,96.79 7.81,96.79 8.71,95.89 C4.2 9.36,95.32 9.36,95.17 9.53,95 IC6.11 v9.53,92.71 9.33,92.91 9.27,92.85 9.27,92.35 8.77,91.85 8.06,91.85 7,92.91 v6.18,92.91 | IC7.2 1.91,60.39 v1.97,60.33 | v2.38,70.48 2.32,70.54 C6.2

### Text on the board
bDocu: Jinx 1.0, CC-By-SA, 2019 Forestcaver / (adapted from an Emilie Gillet design).